# Altium schematic sheet Top-Sheet.SchDoc
size A; DocumentNumber: 1; SheetNumber: 1; SheetTotal: 5
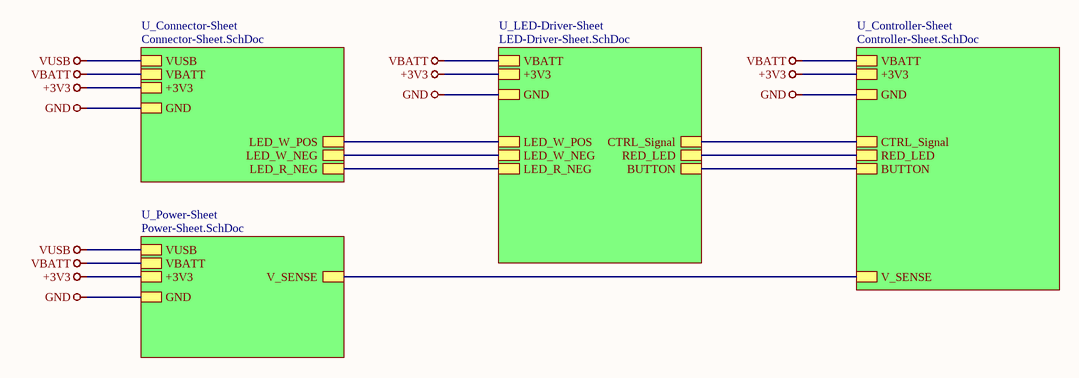
[diagram p0: Top-Sheet.SchDoc]

## Sub-sheets
U_Connector-Sheet = Connector-Sheet.SchDoc: VUSB, LED_W_POS, LED_W_NEG, LED_R_NEG, GND, +3V3, VBATT
U_Controller-Sheet = Controller-Sheet.SchDoc: GND, +3V3, RED_LED, CTRL_Signal, BUTTON, VBATT, V_SENSE
U_LED-Driver-Sheet = LED-Driver-Sheet.SchDoc: GND, +3V3, RED_LED, CTRL_Signal, BUTTON, VBATT, LED_W_POS, LED_W_NEG, LED_R_NEG
U_Power-Sheet = Power-Sheet.SchDoc: GND, +3V3, VUSB, VBATT, V_SENSE

## Nets
+3V3: sheet U_Connector-Sheet/+3V3, sheet U_Controller-Sheet/+3V3, sheet U_LED-Driver-Sheet/+3V3, sheet U_Power-Sheet/+3V3
GND: sheet U_Connector-Sheet/GND, sheet U_Controller-Sheet/GND, sheet U_LED-Driver-Sheet/GND, sheet U_Power-Sheet/GND
VBATT: sheet U_Connector-Sheet/VBATT, sheet U_Controller-Sheet/VBATT, sheet U_LED-Driver-Sheet/VBATT, sheet U_Power-Sheet/VBATT
VUSB: sheet U_Connector-Sheet/VUSB, sheet U_Power-Sheet/VUSB
(unnamed): sheet U_Connector-Sheet/LED_W_POS, sheet U_LED-Driver-Sheet/LED_W_POS
(unnamed): sheet U_Connector-Sheet/LED_W_NEG, sheet U_LED-Driver-Sheet/LED_W_NEG
(unnamed): sheet U_Connector-Sheet/LED_R_NEG, sheet U_LED-Driver-Sheet/LED_R_NEG
(unnamed): sheet U_Controller-Sheet/RED_LED, sheet U_LED-Driver-Sheet/RED_LED
(unnamed): sheet U_Controller-Sheet/CTRL_Signal, sheet U_LED-Driver-Sheet/CTRL_Signal
(unnamed): sheet U_Controller-Sheet/BUTTON, sheet U_LED-Driver-Sheet/BUTTON
(unnamed): sheet U_Controller-Sheet/V_SENSE, sheet U_Power-Sheet/V_SENSE